# EAGLE schematic pinouts (EAGLE 7.7.0)
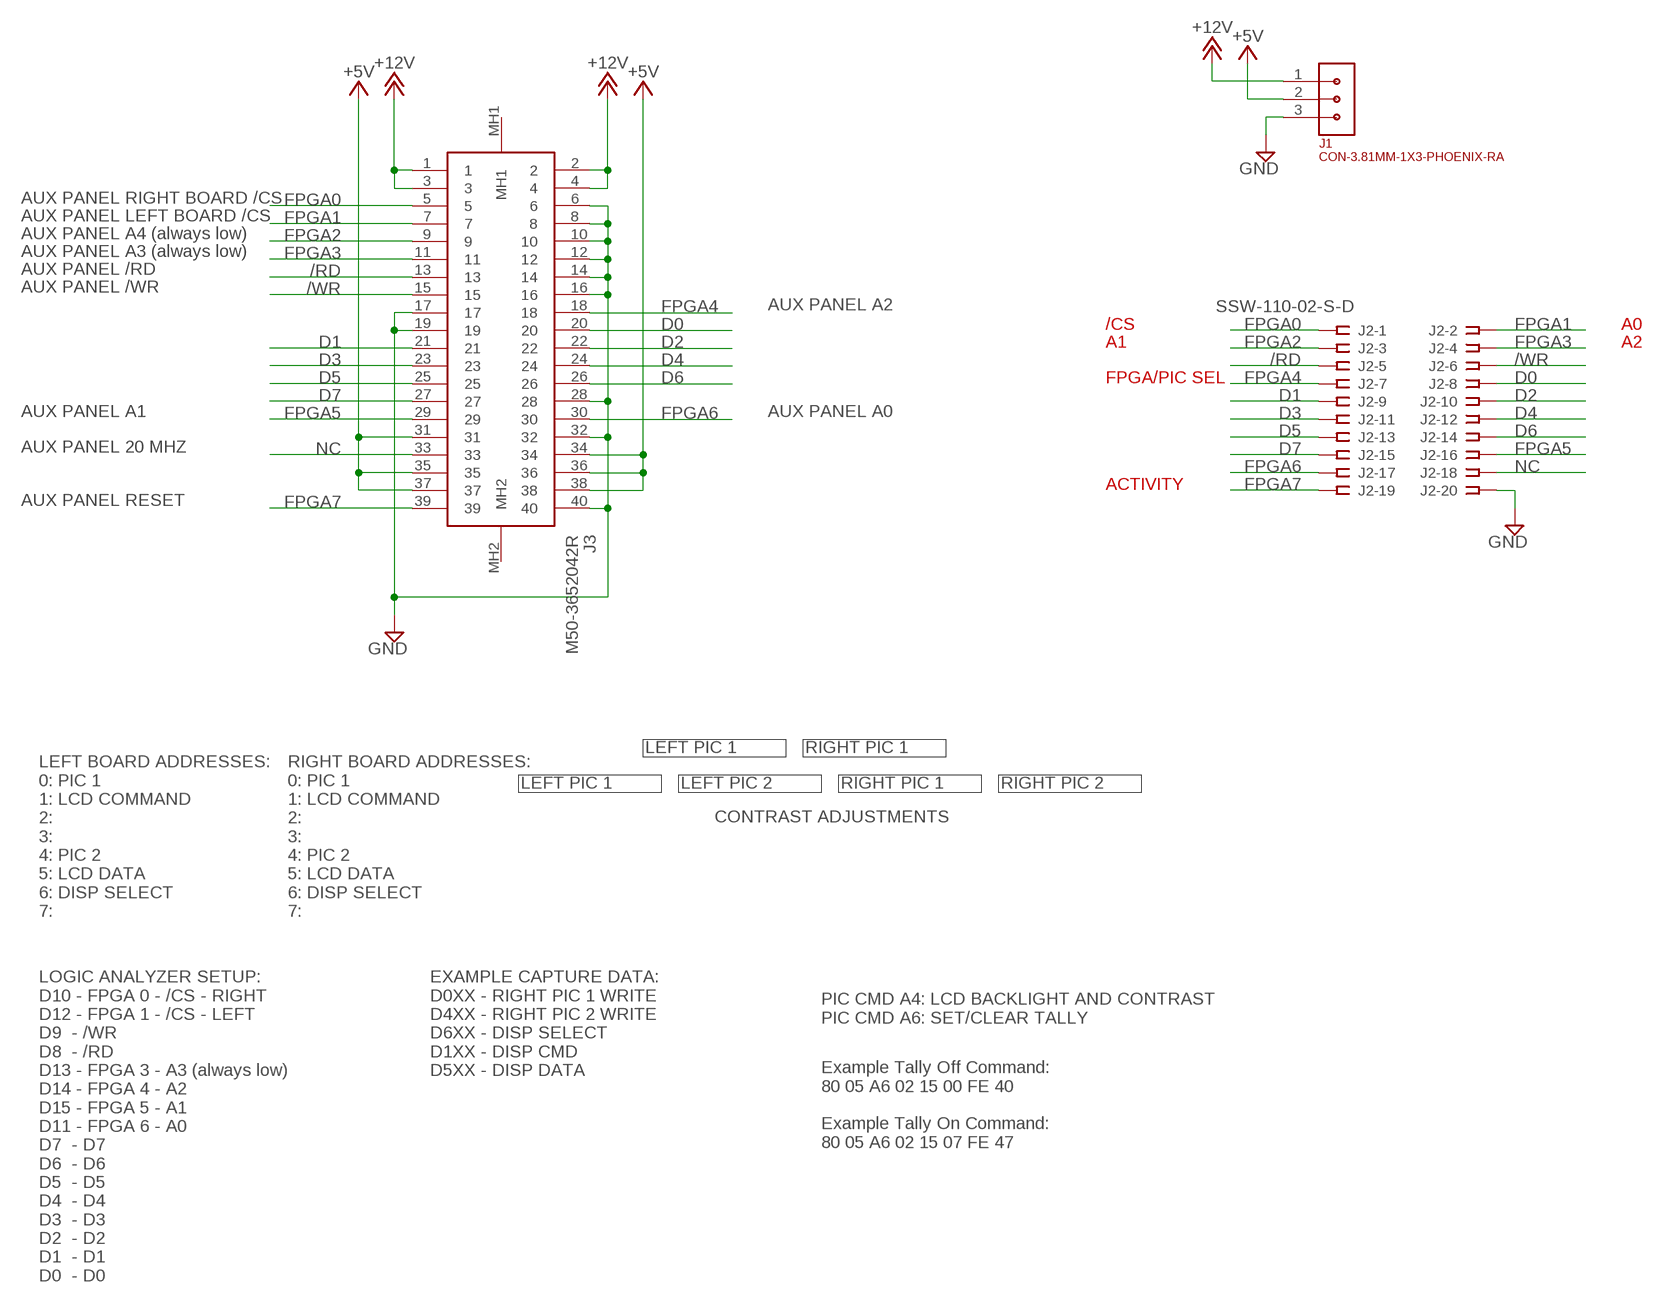
[diagram p0: schematic, sheet 1]

## Parts
J1  CON-3.81MM-1X3-PHOENIX-RA  [CON-PHOENIX-3.81-1X3-RA]
J2  SSW-110-02-S-D  [SSW-110-02-S-D]
J3  M50-3652042R  [M503652042R]

## Nets
+5V: J1.2 J3.31 J3.34 J3.35 J3.36 J3.37 J3.38
+12V: J1.1 J3.1 J3.2 J3.3 J3.4
/RD: J2.5 J3.13
/WR: J2.6 J3.15
D0: J2.8 J3.20
D1: J2.9 J3.21
D2: J2.10 J3.22
D3: J2.11 J3.23
D4: J2.12 J3.24
D5: J2.13 J3.25
D6: J2.14 J3.26
D7: J2.15 J3.27
FPGA0: J2.1 J3.5
FPGA1: J2.2 J3.7
FPGA2: J2.3 J3.9
FPGA3: J2.4 J3.11
FPGA4: J2.7 J3.18
FPGA5: J2.16 J3.29
FPGA6: J2.17 J3.30
FPGA7: J2.19 J3.39
GND: J1.3 J2.20 J3.6 J3.8 J3.10 J3.12 J3.14 J3.16 J3.17 J3.19 J3.28 J3.32 J3.40
NC: J2.18 J3.33
Unconnected: J3.MH1 J3.MH2

## Notes on the sheet
- AUX PANEL RIGHT BOARD /CS
- AUX PANEL LEFT BOARD /CS
- AUX PANEL A4 (always low)
- AUX PANEL A3 (always low)
- AUX PANEL /RD
- AUX PANEL /WR
- AUX PANEL A2
- /CS | A0
- A1 | A2
- FPGA/PIC SEL
- AUX PANEL A1 | AUX PANEL A0
- AUX PANEL 20 MHZ
- ACTIVITY
- AUX PANEL RESET
- LEFT PIC 1 | RIGHT PIC 1
- LEFT BOARD ADDRESSES:
  0: PIC 1
  1: LCD COMMAND
  2: 
  3: 
  4: PIC 2
  5: LCD DATA
  6: DISP SELECT
  7:
- RIGHT BOARD ADDRESSES:
  0: PIC 1
  1: LCD COMMAND
  2: 
  3: 
  4: PIC 2
  5: LCD DATA
  6: DISP SELECT
  7:
- LEFT PIC 1 | LEFT PIC 2 | RIGHT PIC 1 | RIGHT PIC 2
- CONTRAST ADJUSTMENTS
- LOGIC ANALYZER SETUP:
  D10 - FPGA 0 - /CS - RIGHT
  D12 - FPGA 1 - /CS - LEFT
  D9  - /WR
  D8  - /RD
  D13 - FPGA 3 - A3 (always low)
  D14 - FPGA 4 - A2
  D15 - FPGA 5 - A1
  D11 - FPGA 6 - A0
  D7  - D7
  D6  - D6
  D5  - D5
  D4  - D4
  D3  - D3
  D2  - D2
  D1  - D1
  D0  - D0
- EXAMPLE CAPTURE DATA:
  D0XX - RIGHT PIC 1 WRITE
  D4XX - RIGHT PIC 2 WRITE
  D6XX - DISP SELECT
  D1XX - DISP CMD
  D5XX - DISP DATA
- PIC CMD A4: LCD BACKLIGHT AND CONTRAST
  PIC CMD A6: SET/CLEAR TALLY
- Example Tally Off Command:
  80 05 A6 02 15 00 FE 40
  
  Example Tally On Command:
  80 05 A6 02 15 07 FE 47

## Library data of the parts
J1 = 0GlenConnectors:CON-3.81MM-1X3-PHOENIX-RA
J2 = con-samtec:SSW-110-02-S-D: THROUGH-HOLE .025" SQ POST SOCKET Source: Samtec SSW.pdf; MPN: SSW-110-02-S-D; OC_FARNELL: unknown; OC_NEWARK: 11P9480
J3 = M50-3652042R:M50-3652042R: HARWIN Archer M50, 1.27mm Pitch, 40 Way, 2 Row, Vertical PCB Header, Surface Mount Source: Datasheet <https://componentsearchengine.com/Datasheets/1/M50-3652042R.pdf>; ARROW_PART_NUMBER: M50-3652042R; DESCRIPTION: HARWIN Archer M50, 1.27mm Pitch, 40 Way, 2 Row, Vertical PCB Header, Surface Mount; HEIGHT: 11.6mm; MANUFACTURER_NAME: Harwin; MANUFACTURER_PART_NUMBER: M50-3652042R; MOUSER_PART_NUMBER: 855-M50-3652042R; MOUSER_PRICE-STOCK: https://www.mouser.co.uk/ProductDetail/Harwin/M50-3652042R?qs=gf2s0yP%252B7bfJki3ikJTXrQ%3D%3D